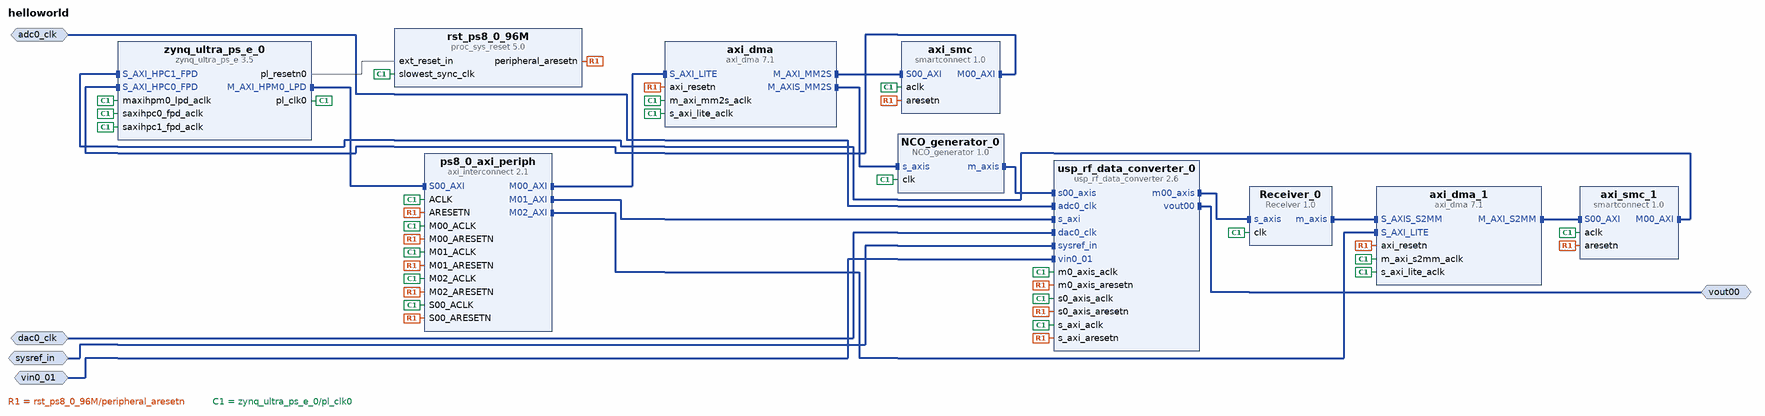
[diagram p0: block diagram of the top level]
# Vivado block design helloworld, xczu28dr-ffvg1517-2-e, Vivado 2023.1
create_bd_design helloworld

create_bd_intf_port -mode Slave -vlnv xilinx.com:display_usp_rf_data_converter:diff_pins_rtl:1.0 sysref_in
create_bd_intf_port -mode Slave -vlnv xilinx.com:interface:diff_clock_rtl:1.0 adc0_clk
set_property -dict {CONFIG.FREQ_HZ 2000000000.0} [get_bd_intf_ports adc0_clk]
create_bd_intf_port -mode Slave -vlnv xilinx.com:interface:diff_analog_io_rtl:1.0 vin0_01
create_bd_intf_port -mode Slave -vlnv xilinx.com:interface:diff_clock_rtl:1.0 dac0_clk
set_property -dict {CONFIG.FREQ_HZ 6400000000.0} [get_bd_intf_ports dac0_clk]
create_bd_intf_port -mode Master -vlnv xilinx.com:interface:diff_analog_io_rtl:1.0 vout00

create_bd_cell -type ip -vlnv strath.ac.uk:SysGen:Receiver:1.0 Receiver_0
create_bd_cell -type ip -vlnv strath.ac.uk:SysGen:NCO_generator:1.0 NCO_generator_0
create_bd_cell -type ip -vlnv xilinx.com:ip:axi_dma:7.1 axi_dma_1
set_property -dict [list \
  CONFIG.c_include_mm2s 0 \
  CONFIG.c_include_s2mm_dre 1 \
  CONFIG.c_include_sg 0 \
  CONFIG.c_s2mm_burst_size 256 \
] [get_bd_cells axi_dma_1]
create_bd_cell -type ip -vlnv xilinx.com:ip:axi_dma:7.1 axi_dma
set_property -dict [list \
  CONFIG.c_include_mm2s_dre 1 \
  CONFIG.c_include_s2mm 0 \
  CONFIG.c_include_sg 0 \
  CONFIG.c_m_axi_mm2s_data_width 128 \
  CONFIG.c_m_axis_mm2s_tdata_width 32 \
  CONFIG.c_mm2s_burst_size 256 \
] [get_bd_cells axi_dma]
create_bd_cell -type ip -vlnv xilinx.com:ip:smartconnect:1.0 axi_smc_1
set_property -dict {CONFIG.NUM_SI 1} [get_bd_cells axi_smc_1]
create_bd_cell -type ip -vlnv xilinx.com:ip:smartconnect:1.0 axi_smc
set_property -dict {CONFIG.NUM_SI 1} [get_bd_cells axi_smc]
create_bd_cell -type ip -vlnv xilinx.com:ip:axi_interconnect:2.1 ps8_0_axi_periph
set_property -dict {CONFIG.NUM_MI 3} [get_bd_cells ps8_0_axi_periph]
create_bd_cell -type ip -vlnv xilinx.com:ip:proc_sys_reset:5.0 rst_ps8_0_96M
create_bd_cell -type ip -vlnv xilinx.com:ip:usp_rf_data_converter:2.6 usp_rf_data_converter_0
set_property -dict [list \
  CONFIG.DAC_Interpolation_Mode00 1 \
  CONFIG.DAC_Mixer_Type00 0 \
  CONFIG.DAC_Slice00_Enable true \
] [get_bd_cells usp_rf_data_converter_0]
create_bd_cell -type ip -vlnv xilinx.com:ip:zynq_ultra_ps_e:3.5 zynq_ultra_ps_e_0
set_property -dict [list \
  CONFIG.CAN0_BOARD_INTERFACE custom \
  CONFIG.CAN1_BOARD_INTERFACE custom \
  CONFIG.CSU_BOARD_INTERFACE custom \
  CONFIG.DP_BOARD_INTERFACE custom \
  CONFIG.GEM0_BOARD_INTERFACE custom \
  CONFIG.GEM1_BOARD_INTERFACE custom \
  CONFIG.GEM2_BOARD_INTERFACE custom \
  CONFIG.GEM3_BOARD_INTERFACE custom \
  CONFIG.GPIO_BOARD_INTERFACE custom \
  CONFIG.IIC0_BOARD_INTERFACE custom \
  CONFIG.IIC1_BOARD_INTERFACE custom \
  CONFIG.NAND_BOARD_INTERFACE custom \
  CONFIG.PCIE_BOARD_INTERFACE custom \
  CONFIG.PJTAG_BOARD_INTERFACE custom \
  CONFIG.PMU_BOARD_INTERFACE custom \
  CONFIG.PSU_BANK_0_IO_STANDARD LVCMOS33 \
  CONFIG.PSU_BANK_1_IO_STANDARD LVCMOS33 \
  CONFIG.PSU_BANK_2_IO_STANDARD LVCMOS33 \
  CONFIG.PSU_BANK_3_IO_STANDARD LVCMOS33 \
  CONFIG.PSU_USB3__DUAL_CLOCK_ENABLE 0 \
  CONFIG.PSU__CAN1__PERIPHERAL__ENABLE 0 \
  CONFIG.PSU__CRF_APB__ACPU_CTRL__FREQMHZ 1333.333 \
  CONFIG.PSU__CRF_APB__ACPU_CTRL__SRCSEL APLL \
  CONFIG.PSU__CRF_APB__APLL_CTRL__SRCSEL PSS_REF_CLK \
  CONFIG.PSU__CRF_APB__DBG_FPD_CTRL__FREQMHZ 250 \
  CONFIG.PSU__CRF_APB__DBG_FPD_CTRL__SRCSEL IOPLL \
  CONFIG.PSU__CRF_APB__DBG_TRACE_CTRL__FREQMHZ 250 \
  CONFIG.PSU__CRF_APB__DBG_TRACE_CTRL__SRCSEL IOPLL \
  CONFIG.PSU__CRF_APB__DBG_TSTMP_CTRL__FREQMHZ 250 \
  CONFIG.PSU__CRF_APB__DBG_TSTMP_CTRL__SRCSEL IOPLL \
  CONFIG.PSU__CRF_APB__DDR_CTRL__FREQMHZ 800 \
  CONFIG.PSU__CRF_APB__DDR_CTRL__SRCSEL DPLL \
  CONFIG.PSU__CRF_APB__DPDMA_REF_CTRL__FREQMHZ 600 \
  CONFIG.PSU__CRF_APB__DPDMA_REF_CTRL__SRCSEL DPLL \
  CONFIG.PSU__CRF_APB__DPLL_CTRL__SRCSEL PSS_REF_CLK \
  CONFIG.PSU__CRF_APB__DP_AUDIO_REF_CTRL__SRCSEL VPLL \
  CONFIG.PSU__CRF_APB__DP_STC_REF_CTRL__SRCSEL VPLL \
  CONFIG.PSU__CRF_APB__DP_VIDEO_REF_CTRL__SRCSEL DPLL \
  CONFIG.PSU__CRF_APB__GDMA_REF_CTRL__FREQMHZ 600 \
  CONFIG.PSU__CRF_APB__GDMA_REF_CTRL__SRCSEL DPLL \
  CONFIG.PSU__CRF_APB__GPU_REF_CTRL__FREQMHZ 600 \
  CONFIG.PSU__CRF_APB__GPU_REF_CTRL__SRCSEL DPLL \
  CONFIG.PSU__CRF_APB__TOPSW_LSBUS_CTRL__FREQMHZ 100 \
  CONFIG.PSU__CRF_APB__TOPSW_LSBUS_CTRL__SRCSEL IOPLL \
  CONFIG.PSU__CRF_APB__TOPSW_MAIN_CTRL__FREQMHZ 533.333 \
  CONFIG.PSU__CRF_APB__TOPSW_MAIN_CTRL__SRCSEL VPLL \
  CONFIG.PSU__CRF_APB__VPLL_CTRL__SRCSEL PSS_REF_CLK \
  CONFIG.PSU__CRL_APB__ADMA_REF_CTRL__FREQMHZ 533.333 \
  CONFIG.PSU__CRL_APB__ADMA_REF_CTRL__SRCSEL RPLL \
  CONFIG.PSU__CRL_APB__CAN1_REF_CTRL__FREQMHZ 100 \
  CONFIG.PSU__CRL_APB__CAN1_REF_CTRL__SRCSEL IOPLL \
  CONFIG.PSU__CRL_APB__CPU_R5_CTRL__FREQMHZ 533.333 \
  CONFIG.PSU__CRL_APB__CPU_R5_CTRL__SRCSEL RPLL \
  CONFIG.PSU__CRL_APB__DBG_LPD_CTRL__FREQMHZ 250 \
  CONFIG.PSU__CRL_APB__DBG_LPD_CTRL__SRCSEL IOPLL \
  CONFIG.PSU__CRL_APB__GEM3_REF_CTRL__FREQMHZ 125 \
  CONFIG.PSU__CRL_APB__GEM3_REF_CTRL__SRCSEL IOPLL \
  CONFIG.PSU__CRL_APB__I2C0_REF_CTRL__FREQMHZ 100 \
  CONFIG.PSU__CRL_APB__I2C0_REF_CTRL__SRCSEL IOPLL \
  CONFIG.PSU__CRL_APB__I2C1_REF_CTRL__FREQMHZ 100 \
  CONFIG.PSU__CRL_APB__I2C1_REF_CTRL__SRCSEL IOPLL \
  CONFIG.PSU__CRL_APB__IOPLL_CTRL__SRCSEL PSS_REF_CLK \
  CONFIG.PSU__CRL_APB__IOU_SWITCH_CTRL__FREQMHZ 267 \
  CONFIG.PSU__CRL_APB__IOU_SWITCH_CTRL__SRCSEL RPLL \
  CONFIG.PSU__CRL_APB__LPD_LSBUS_CTRL__FREQMHZ 100 \
  CONFIG.PSU__CRL_APB__LPD_LSBUS_CTRL__SRCSEL IOPLL \
  CONFIG.PSU__CRL_APB__LPD_SWITCH_CTRL__FREQMHZ 533.333 \
  CONFIG.PSU__CRL_APB__LPD_SWITCH_CTRL__SRCSEL RPLL \
  CONFIG.PSU__CRL_APB__PCAP_CTRL__FREQMHZ 200 \
  CONFIG.PSU__CRL_APB__PCAP_CTRL__SRCSEL IOPLL \
  CONFIG.PSU__CRL_APB__PL0_REF_CTRL__FREQMHZ 100 \
  CONFIG.PSU__CRL_APB__PL0_REF_CTRL__SRCSEL RPLL \
  CONFIG.PSU__CRL_APB__QSPI_REF_CTRL__FREQMHZ 300 \
  CONFIG.PSU__CRL_APB__QSPI_REF_CTRL__SRCSEL IOPLL \
  CONFIG.PSU__CRL_APB__RPLL_CTRL__SRCSEL PSS_REF_CLK \
  CONFIG.PSU__CRL_APB__SDIO1_REF_CTRL__FREQMHZ 200 \
  CONFIG.PSU__CRL_APB__SDIO1_REF_CTRL__SRCSEL RPLL \
  CONFIG.PSU__CRL_APB__TIMESTAMP_REF_CTRL__FREQMHZ 100 \
  CONFIG.PSU__CRL_APB__TIMESTAMP_REF_CTRL__SRCSEL PSS_REF_CLK \
  CONFIG.PSU__CRL_APB__UART0_REF_CTRL__FREQMHZ 100 \
  CONFIG.PSU__CRL_APB__UART0_REF_CTRL__SRCSEL IOPLL \
  CONFIG.PSU__CRL_APB__UART1_REF_CTRL__FREQMHZ 100 \
  CONFIG.PSU__CRL_APB__UART1_REF_CTRL__SRCSEL IOPLL \
  CONFIG.PSU__CRL_APB__USB0_BUS_REF_CTRL__FREQMHZ 250 \
  CONFIG.PSU__CRL_APB__USB0_BUS_REF_CTRL__SRCSEL IOPLL \
  CONFIG.PSU__CRL_APB__USB3_DUAL_REF_CTRL__FREQMHZ 20 \
  CONFIG.PSU__CRL_APB__USB3_DUAL_REF_CTRL__SRCSEL IOPLL \
  CONFIG.PSU__CRL_APB__USB3__ENABLE 0 \
  CONFIG.PSU__CSUPMU__PERIPHERAL__VALID 0 \
  CONFIG.PSU__DDRC__BUS_WIDTH {64 Bit} \
  CONFIG.PSU__DDRC__COMPONENTS Components \
  CONFIG.PSU__DDRC__DEVICE_CAPACITY {2048 MBits} \
  CONFIG.PSU__DDRC__DRAM_WIDTH {8 Bits} \
  CONFIG.PSU__DDRC__ECC Disabled \
  CONFIG.PSU__DDRC__MEMORY_TYPE {DDR 4} \
  CONFIG.PSU__DDRC__SPEED_BIN DDR4_1600J \
  CONFIG.PSU__DDR_HIGH_ADDRESS_GUI_ENABLE 0 \
  CONFIG.PSU__DDR__INTERFACE__FREQMHZ 400.000 \
  CONFIG.PSU__DEVICE_TYPE RFSOC \
  CONFIG.PSU__DISPLAYPORT__PERIPHERAL__ENABLE 0 \
  CONFIG.PSU__DLL__ISUSED 0 \
  CONFIG.PSU__ENET3__PERIPHERAL__ENABLE 0 \
  CONFIG.PSU__FPD_SLCR__WDT1__FREQMHZ 100 \
  CONFIG.PSU__FPGA_PL0_ENABLE 1 \
  CONFIG.PSU__GPIO0_MIO__PERIPHERAL__ENABLE 0 \
  CONFIG.PSU__GPIO1_MIO__PERIPHERAL__ENABLE 0 \
  CONFIG.PSU__GPU_PP0__POWER__ON 0 \
  CONFIG.PSU__GPU_PP1__POWER__ON 0 \
  CONFIG.PSU__I2C0__PERIPHERAL__ENABLE 0 \
  CONFIG.PSU__I2C1__PERIPHERAL__ENABLE 0 \
  CONFIG.PSU__IOU_SLCR__IOU_TTC_APB_CLK__TTC0_SEL APB \
  CONFIG.PSU__IOU_SLCR__IOU_TTC_APB_CLK__TTC1_SEL APB \
  CONFIG.PSU__IOU_SLCR__IOU_TTC_APB_CLK__TTC2_SEL APB \
  CONFIG.PSU__IOU_SLCR__IOU_TTC_APB_CLK__TTC3_SEL APB \
  CONFIG.PSU__IOU_SLCR__TTC0__FREQMHZ 100 \
  CONFIG.PSU__IOU_SLCR__TTC1__FREQMHZ 100 \
  CONFIG.PSU__IOU_SLCR__TTC2__FREQMHZ 100 \
  CONFIG.PSU__IOU_SLCR__TTC3__FREQMHZ 100 \
  CONFIG.PSU__IOU_SLCR__WDT0__FREQMHZ 100 \
  CONFIG.PSU__LPD_SLCR__CSUPMU__FREQMHZ 100 \
  CONFIG.PSU__OVERRIDE_HPX_QOS 0 \
  CONFIG.PSU__OVERRIDE__BASIC_CLOCK 0 \
  CONFIG.PSU__PMU__PERIPHERAL__ENABLE 0 \
  CONFIG.PSU__PRESET_APPLIED 0 \
  CONFIG.PSU__PSS_REF_CLK__FREQMHZ 33.333 \
  CONFIG.PSU__QSPI__PERIPHERAL__ENABLE 0 \
  CONFIG.PSU__SATA__PERIPHERAL__ENABLE 0 \
  CONFIG.PSU__SD0__CLK_100_SDR_OTAP_DLY 0x3 \
  CONFIG.PSU__SD0__CLK_200_SDR_OTAP_DLY 0x3 \
  CONFIG.PSU__SD0__CLK_50_DDR_ITAP_DLY 0x3D \
  CONFIG.PSU__SD0__CLK_50_DDR_OTAP_DLY 0x4 \
  CONFIG.PSU__SD0__CLK_50_SDR_ITAP_DLY 0x15 \
  CONFIG.PSU__SD0__CLK_50_SDR_OTAP_DLY 0x5 \
  CONFIG.PSU__SD1__CLK_100_SDR_OTAP_DLY 0x3 \
  CONFIG.PSU__SD1__CLK_200_SDR_OTAP_DLY 0x3 \
  CONFIG.PSU__SD1__CLK_50_DDR_ITAP_DLY 0x3D \
  CONFIG.PSU__SD1__CLK_50_DDR_OTAP_DLY 0x4 \
  CONFIG.PSU__SD1__CLK_50_SDR_ITAP_DLY 0x15 \
  CONFIG.PSU__SD1__CLK_50_SDR_OTAP_DLY 0x5 \
  CONFIG.PSU__SD1__PERIPHERAL__ENABLE 0 \
  CONFIG.PSU__SWDT0__PERIPHERAL__ENABLE 0 \
  CONFIG.PSU__SWDT1__PERIPHERAL__ENABLE 0 \
  CONFIG.PSU__TTC0__PERIPHERAL__ENABLE 0 \
  CONFIG.PSU__TTC1__PERIPHERAL__ENABLE 0 \
  CONFIG.PSU__TTC2__PERIPHERAL__ENABLE 0 \
  CONFIG.PSU__TTC3__PERIPHERAL__ENABLE 0 \
  CONFIG.PSU__UART0__PERIPHERAL__ENABLE 0 \
  CONFIG.PSU__UART1__PERIPHERAL__ENABLE 0 \
  CONFIG.PSU__USB0__PERIPHERAL__ENABLE 0 \
  CONFIG.PSU__USE__IRQ0 0 \
  CONFIG.PSU__USE__M_AXI_GP0 0 \
  CONFIG.PSU__USE__M_AXI_GP1 0 \
  CONFIG.PSU__USE__M_AXI_GP2 1 \
  CONFIG.PSU__USE__S_AXI_GP0 1 \
  CONFIG.PSU__USE__S_AXI_GP1 1 \
  CONFIG.QSPI_BOARD_INTERFACE custom \
  CONFIG.SATA_BOARD_INTERFACE custom \
  CONFIG.SD0_BOARD_INTERFACE custom \
  CONFIG.SD1_BOARD_INTERFACE custom \
  CONFIG.SPI0_BOARD_INTERFACE custom \
  CONFIG.SPI1_BOARD_INTERFACE custom \
  CONFIG.SUBPRESET1 Custom \
  CONFIG.SUBPRESET2 Custom \
  CONFIG.SWDT0_BOARD_INTERFACE custom \
  CONFIG.SWDT1_BOARD_INTERFACE custom \
  CONFIG.TRACE_BOARD_INTERFACE custom \
  CONFIG.TTC0_BOARD_INTERFACE custom \
  CONFIG.TTC1_BOARD_INTERFACE custom \
  CONFIG.TTC2_BOARD_INTERFACE custom \
  CONFIG.TTC3_BOARD_INTERFACE custom \
  CONFIG.UART0_BOARD_INTERFACE custom \
  CONFIG.UART1_BOARD_INTERFACE custom \
  CONFIG.USB0_BOARD_INTERFACE custom \
  CONFIG.USB1_BOARD_INTERFACE custom \
] [get_bd_cells zynq_ultra_ps_e_0]
# 750 more settings of zynq_ultra_ps_e_0 are not shown: defaults, MIO pin electricals, DDR timing, and values the tool derives

# ---- connections ----

connect_bd_intf_net [get_bd_intf_pins NCO_generator_0/m_axis] [get_bd_intf_pins usp_rf_data_converter_0/s00_axis]
connect_bd_intf_net [get_bd_intf_pins Receiver_0/m_axis] [get_bd_intf_pins axi_dma_1/S_AXIS_S2MM]
connect_bd_intf_net [get_bd_intf_ports adc0_clk] [get_bd_intf_pins usp_rf_data_converter_0/adc0_clk]
connect_bd_intf_net [get_bd_intf_pins axi_dma_1/M_AXI_S2MM] [get_bd_intf_pins axi_smc_1/S00_AXI]
connect_bd_intf_net [get_bd_intf_pins NCO_generator_0/s_axis] [get_bd_intf_pins axi_dma/M_AXIS_MM2S]
connect_bd_intf_net [get_bd_intf_pins axi_dma/M_AXI_MM2S] [get_bd_intf_pins axi_smc/S00_AXI]
connect_bd_intf_net [get_bd_intf_pins axi_smc_1/M00_AXI] [get_bd_intf_pins zynq_ultra_ps_e_0/S_AXI_HPC1_FPD]
connect_bd_intf_net [get_bd_intf_pins axi_smc/M00_AXI] [get_bd_intf_pins zynq_ultra_ps_e_0/S_AXI_HPC0_FPD]
connect_bd_intf_net [get_bd_intf_ports dac0_clk] [get_bd_intf_pins usp_rf_data_converter_0/dac0_clk]
connect_bd_intf_net [get_bd_intf_pins ps8_0_axi_periph/M00_AXI] [get_bd_intf_pins axi_dma/S_AXI_LITE]
connect_bd_intf_net [get_bd_intf_pins ps8_0_axi_periph/M01_AXI] [get_bd_intf_pins usp_rf_data_converter_0/s_axi]
connect_bd_intf_net [get_bd_intf_pins ps8_0_axi_periph/M02_AXI] [get_bd_intf_pins axi_dma_1/S_AXI_LITE]
connect_bd_intf_net [get_bd_intf_ports sysref_in] [get_bd_intf_pins usp_rf_data_converter_0/sysref_in]
connect_bd_intf_net [get_bd_intf_pins usp_rf_data_converter_0/m00_axis] [get_bd_intf_pins Receiver_0/s_axis]
connect_bd_intf_net [get_bd_intf_ports vout00] [get_bd_intf_pins usp_rf_data_converter_0/vout00]
connect_bd_intf_net -intf_net vin0_01_1 [get_bd_intf_ports vin0_01] [get_bd_intf_pins usp_rf_data_converter_0/vin0_01]
connect_bd_intf_net [get_bd_intf_pins zynq_ultra_ps_e_0/M_AXI_HPM0_LPD] [get_bd_intf_pins ps8_0_axi_periph/S00_AXI]
connect_bd_net [get_bd_pins rst_ps8_0_96M/peripheral_aresetn] \
  [get_bd_pins axi_dma_1/axi_resetn] [get_bd_pins axi_dma/axi_resetn] [get_bd_pins axi_smc_1/aresetn] \
  [get_bd_pins axi_smc/aresetn] [get_bd_pins ps8_0_axi_periph/ARESETN] [get_bd_pins ps8_0_axi_periph/S00_ARESETN] \
  [get_bd_pins ps8_0_axi_periph/M00_ARESETN] [get_bd_pins ps8_0_axi_periph/M01_ARESETN] \
  [get_bd_pins ps8_0_axi_periph/M02_ARESETN] [get_bd_pins usp_rf_data_converter_0/s_axi_aresetn] \
  [get_bd_pins usp_rf_data_converter_0/m0_axis_aresetn] [get_bd_pins usp_rf_data_converter_0/s0_axis_aresetn]
connect_bd_net [get_bd_pins zynq_ultra_ps_e_0/pl_clk0] \
  [get_bd_pins NCO_generator_0/clk] [get_bd_pins Receiver_0/clk] [get_bd_pins axi_dma_1/s_axi_lite_aclk] \
  [get_bd_pins axi_dma_1/m_axi_s2mm_aclk] [get_bd_pins axi_dma/s_axi_lite_aclk] [get_bd_pins axi_dma/m_axi_mm2s_aclk] \
  [get_bd_pins axi_smc_1/aclk] [get_bd_pins axi_smc/aclk] [get_bd_pins ps8_0_axi_periph/ACLK] \
  [get_bd_pins ps8_0_axi_periph/S00_ACLK] [get_bd_pins ps8_0_axi_periph/M00_ACLK] [get_bd_pins ps8_0_axi_periph/M01_ACLK] \
  [get_bd_pins ps8_0_axi_periph/M02_ACLK] [get_bd_pins rst_ps8_0_96M/slowest_sync_clk] \
  [get_bd_pins usp_rf_data_converter_0/s_axi_aclk] [get_bd_pins usp_rf_data_converter_0/m0_axis_aclk] \
  [get_bd_pins usp_rf_data_converter_0/s0_axis_aclk] [get_bd_pins zynq_ultra_ps_e_0/maxihpm0_lpd_aclk] \
  [get_bd_pins zynq_ultra_ps_e_0/saxihpc0_fpd_aclk] [get_bd_pins zynq_ultra_ps_e_0/saxihpc1_fpd_aclk]
connect_bd_net [get_bd_pins zynq_ultra_ps_e_0/pl_resetn0] [get_bd_pins rst_ps8_0_96M/ext_reset_in]

# ---- address map ----
assign_bd_address -offset 0x00000000 -range 2G -target_address_space [get_bd_addr_spaces axi_dma/Data_MM2S] [get_bd_addr_segs zynq_ultra_ps_e_0/SAXIGP0/HPC0_DDR_LOW]
exclude_bd_addr_seg -offset 0xFF000000 -range 16M -target_address_space [get_bd_addr_spaces axi_dma/Data_MM2S] [get_bd_addr_segs zynq_ultra_ps_e_0/SAXIGP0/HPC0_LPS_OCM]
assign_bd_address -offset 0x00000000 -range 2G -target_address_space [get_bd_addr_spaces axi_dma_1/Data_S2MM] [get_bd_addr_segs zynq_ultra_ps_e_0/SAXIGP1/HPC1_DDR_LOW]
exclude_bd_addr_seg -offset 0xFF000000 -range 16M -target_address_space [get_bd_addr_spaces axi_dma_1/Data_S2MM] [get_bd_addr_segs zynq_ultra_ps_e_0/SAXIGP1/HPC1_LPS_OCM]
assign_bd_address -offset 0x0080000000 -range 64K -target_address_space [get_bd_addr_spaces zynq_ultra_ps_e_0/Data] [get_bd_addr_segs axi_dma/S_AXI_LITE/Reg]
assign_bd_address -offset 0x0080010000 -range 64K -target_address_space [get_bd_addr_spaces zynq_ultra_ps_e_0/Data] [get_bd_addr_segs axi_dma_1/S_AXI_LITE/Reg]
assign_bd_address -offset 0x0080040000 -range 256K -target_address_space [get_bd_addr_spaces zynq_ultra_ps_e_0/Data] [get_bd_addr_segs usp_rf_data_converter_0/s_axi/Reg]

validate_bd_design
save_bd_design
